# Altium schematic sheet SensWear-Main.SchDoc
size A4; Size: A4; SheetNumber: 1; SheetTotal: 9
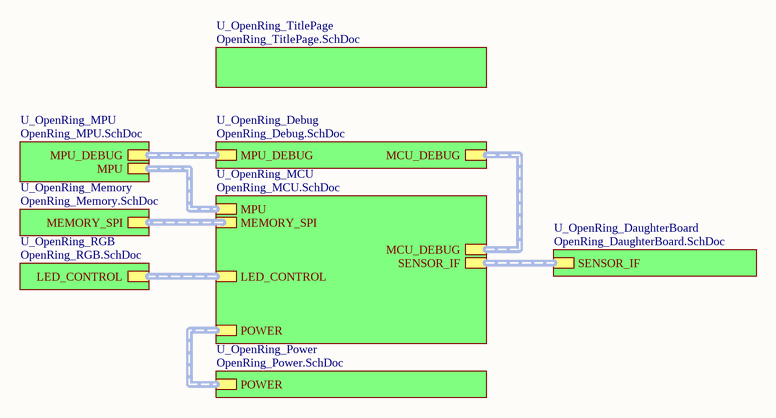
[diagram p0: SensWear-Main.SchDoc]

## Sub-sheets
U_OpenRing_DaughterBoard = OpenRing_DaughterBoard.SchDoc: SENSOR_IF (harness SENSOR_IF)
U_OpenRing_Debug = OpenRing_Debug.SchDoc: MPU_DEBUG (harness MPU_DEBUG), MCU_DEBUG (harness MCU_DEBUG)
U_OpenRing_MCU = OpenRing_MCU.SchDoc: MEMORY_SPI (harness MEMORY_SPI), MPU (harness MPU), SENSOR_IF (harness SENSOR_IF), POWER (harness POWER), MCU_DEBUG (harness MCU_DEBUG), LED_CONTROL (harness LED_CONTROL)
U_OpenRing_Memory = OpenRing_Memory.SchDoc: MEMORY_SPI (harness MEMORY_SPI)
U_OpenRing_MPU = OpenRing_MPU.SchDoc: MPU (harness MPU), MPU_DEBUG (harness MPU_DEBUG)
U_OpenRing_Power = OpenRing_Power.SchDoc: POWER (harness POWER)
U_OpenRing_RGB = OpenRing_RGB.SchDoc: LED_CONTROL (harness LED_CONTROL)
U_OpenRing_TitlePage = OpenRing_TitlePage.SchDoc: no entries

## Buses and harness runs
harness sheet U_OpenRing_DaughterBoard/SENSOR_IF = sheet U_OpenRing_MCU/SENSOR_IF
harness sheet U_OpenRing_Debug/MCU_DEBUG = sheet U_OpenRing_MCU/MCU_DEBUG
harness sheet U_OpenRing_Debug/MPU_DEBUG = sheet U_OpenRing_MPU/MPU_DEBUG
harness sheet U_OpenRing_MCU/LED_CONTROL = sheet U_OpenRing_RGB/LED_CONTROL
harness sheet U_OpenRing_MCU/MEMORY_SPI = sheet U_OpenRing_Memory/MEMORY_SPI
harness sheet U_OpenRing_MCU/MPU = sheet U_OpenRing_MPU/MPU
harness sheet U_OpenRing_MCU/POWER = sheet U_OpenRing_Power/POWER

## Notes on the sheet
- Designer/Engineer
- Drawn By
- Document Name
- Board Title
- Sheet
- of
- Size
- A4
- Approved By
- Rev.
- Date